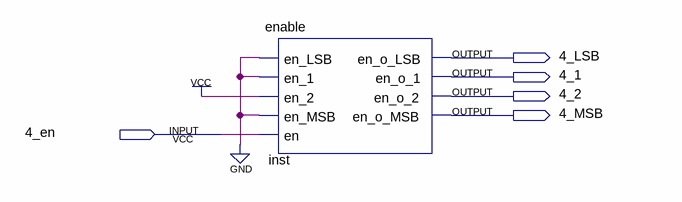
[diagram p0: schematic sheet]
// Quartus schematic 4_en.bdf as structural Verilog: 1 symbols, 5 pins
module \4_en  (
  input  \4_en ,
  output \4_LSB ,
  output \4_1 ,
  output \4_2 ,
  output \4_MSB 
);

  enable inst (
    .en_LSB(1'b0), .en_1(1'b0), .en_2(1'b1), .en_MSB(1'b0), .en(\4_en ), .en_o_LSB(\4_LSB ), .en_o_1(\4_1 ),
    .en_o_2(\4_2 ), .en_o_MSB(\4_MSB ));
endmodule
